# Altium project X_TRACK.PrjPcb
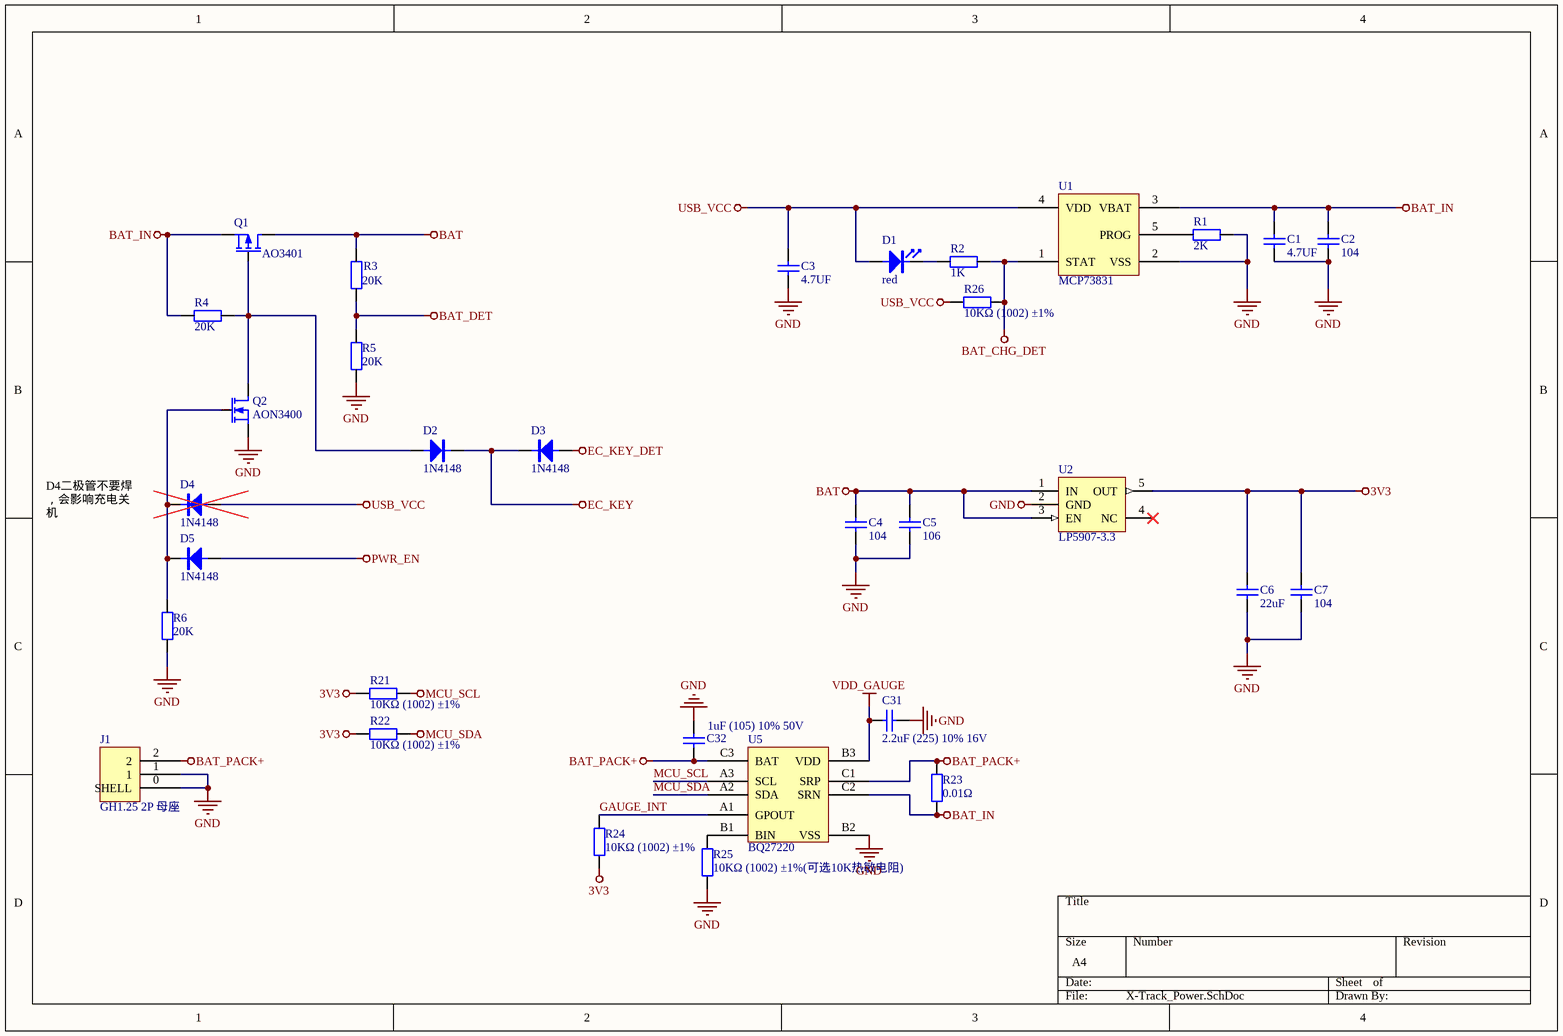
[diagram p0: X-Track_Power.SchDoc]
2 sheets, 86 parts. Net scope: global (net labels, ports and power ports of the same name join across sheets).
Board file: X-Track_2.0.PcbDoc
Sheets:
  X-Track_Power.SchDoc
  X-Track_Sheet.SchDoc

## Sheet X-Track_Power.SchDoc
size A4

### Parts
C1  4.7UF  [电容_C0805]
C2  104  [电容_C0603]
C3  4.7UF  [电容_C0805]
C4  104  [电容_C0603]
C5  106  [电容_C0603]
C6  22uF  [电容_C1206]
C7  104  [电容_C0603]
C31  2.2uF (225) 10% 16V  [0603_C]
C32  1uF (105) 10% 50V  [0603_C]
D1  red  [LED_0603]
D2  1N4148  [二极管_SOD-323]
D3  1N4148  [二极管_SOD-323]
D4  1N4148  [二极管_SOD-323]
D5  1N4148  [二极管_SOD-323]
J1  GH1.25 2P 母座  [GH1.25 2P 母座]
Q1  AO3401  [MOS_SOT-23]
Q2  AON3400  [MOS_SOT-23]
R1  2K  [电阻_R0603]
R2  1K  [电阻_R0603]
R3  20K  [电阻_R0603]
R4  20K  [电阻_R0603]
R5  20K  [电阻_R0603]
R6  20K  [电阻_R0603]
R21  10KΩ (1002) ±1%  [0603_R]
R22  10KΩ (1002) ±1%  [0603_R]
R23  0.01Ω  [0402_R]
R24  10KΩ (1002) ±1%  [0603_R]
R25  10KΩ (1002) ±1%(可选10K热敏电阻)  [0603_R]
R26  10KΩ (1002) ±1%  [0603_R]
U1  MCP73831  [SOT23-5]
U2  LP5907-3.3  [SOT23-5]
U5  BQ27220  [BQ27220]

### Nets
3V3: C6.2 C7.2 R21.2 R22.2 R24.1 U2.5(OUT)
BAT: C4.2 C5.2 Q1.2(D) R3.2 U2.1(IN) U2.3(EN)
BAT_CHG_DET: R2.1 R26.1 U1.1(STAT)
BAT_DET: R3.1 R5.2
BAT_IN: C1.2 C2.1 Q1.3(S) R4.1 R23.1 U1.3(VBAT) U5.C2(SRN)
BAT_PACK+: C32.2 J1.2 R23.2 U5.C1(SRP) U5.C3(BAT)
EC_KEY: D2.K D3.K
EC_KEY_DET: D3.A
GND: C1.1 C2.2 C3.1 C4.1 C5.1 C6.1 C7.1 C31.2 C32.1 J1.0(SHELL) J1.1 Q2.3(S) R1.1 R5.1 R6.2 R25.1 U1.2(VSS) U2.2(GND) U5.B2(VSS)
MCU_SCL: R21.1 U5.A3(SCL)
MCU_SDA: R22.1 U5.A2(SDA)
PWR_EN: D5.A
USB_VCC: C3.2 D1.A D4.A R26.2 U1.4(VDD)
VDD_GAUGE: C31.1 U5.B3(VDD)
GAUGE_INT: R24.2 U5.A1(GPOUT)
NetD1_K: D1.K R2.2
NetD2_A: D2.A Q1.1(G) Q2.2(D) R4.2
NetD4_K: D4.K D5.K Q2.1(G) R6.1
NetR1_2: R1.2 U1.5(PROG)
NetR25_2: R25.2 U5.B1(BIN)

Not connected (* = marked no-connect by the designer): U2 4(NC)*

### Notes on the sheet
- D4二极管不要焊，会影响充电关机

### Library data of the parts
C1-C7 = cap: U: 50V; 参数: Cap,0805,X7R,104K,50V,125C,±10%
  C1 C3: C: 4.7UF
  C2 C4 C7: C: 104
  C5: C: 106
  C6: C: 22uF
C31 = 0603 2.2uF (225) 10% 16V: 贴片电容; ComponentLink1Description: 供应商链接; ComponentLink1URL: http://www.szlcsc.com/product/details_24366.html; Package: 0603; Supplier: LC; SuppliersPartNumber: C23630
C32 = 0603 1uF (105) 10% 50V: 贴片电容; ComponentLink1Description: 供应商链接; ComponentLink1URL: http://www.szlcsc.com/product/details_16531.html; Package: 0603; Supplier: LC; SuppliersPartNumber: C15849
D1 = LED: 参数: LED,0603,Red
D2-D5 = Diode: _Specification: Diode,1N4148,SOD-323,1A,40V; _Comma: ,; _Footprint: SOD-323; _Voltage: 40V; _Current: 1A; _Name: Diode; _Model: 1N4148
Q1 = MOSFET-P: _Comma: ,; _Current: 40A; _Footprint: DFN3.3*3.3; _Name: P-MOSFET; _Specification: P-MOSFET,AO3401,DFN3.3*3.3,40A,20V; _Voltage: 20V; _Model: AO3401
Q2 = MOSFET-N: _Comma: ,; _Current: 150A; _Footprint: DFN5*6; _Name: N-MOSFET; _Specification: N-MOSFET,AON3400,DFN5*6,150A,30V; _Voltage: 30V; _Model: AON3400
R1-R6 = Res: P: 1/8W; 参数: Res,0805,0R,±1%,1/8W,100ppm,155C
  R1: R: 2K
  R2: R: 1K
  R3-R6: R: 20K
R21 R22 R24-R26 = 0603 10KΩ (1002) 1%: 贴片电阻; ComponentLink1Description: 供应商链接; ComponentLink1URL: http://www.szlcsc.com/product/details_26547.html; Package: 0603; Supplier: LC; SuppliersPartNumber: C25804
R23 = 0402 49.9Ω (49R9) 1%: 贴片电阻; ComponentLink1Description: 供应商链接; ComponentLink1URL: http://www.szlcsc.com/product/details_25863.html; Package: 0402; Supplier: LC; SuppliersPartNumber: C25120
U1 = MCP73831: 线性充电管理控制器
U2 = LP5907: LDO

## Sheet X-Track_Sheet.SchDoc
size A3
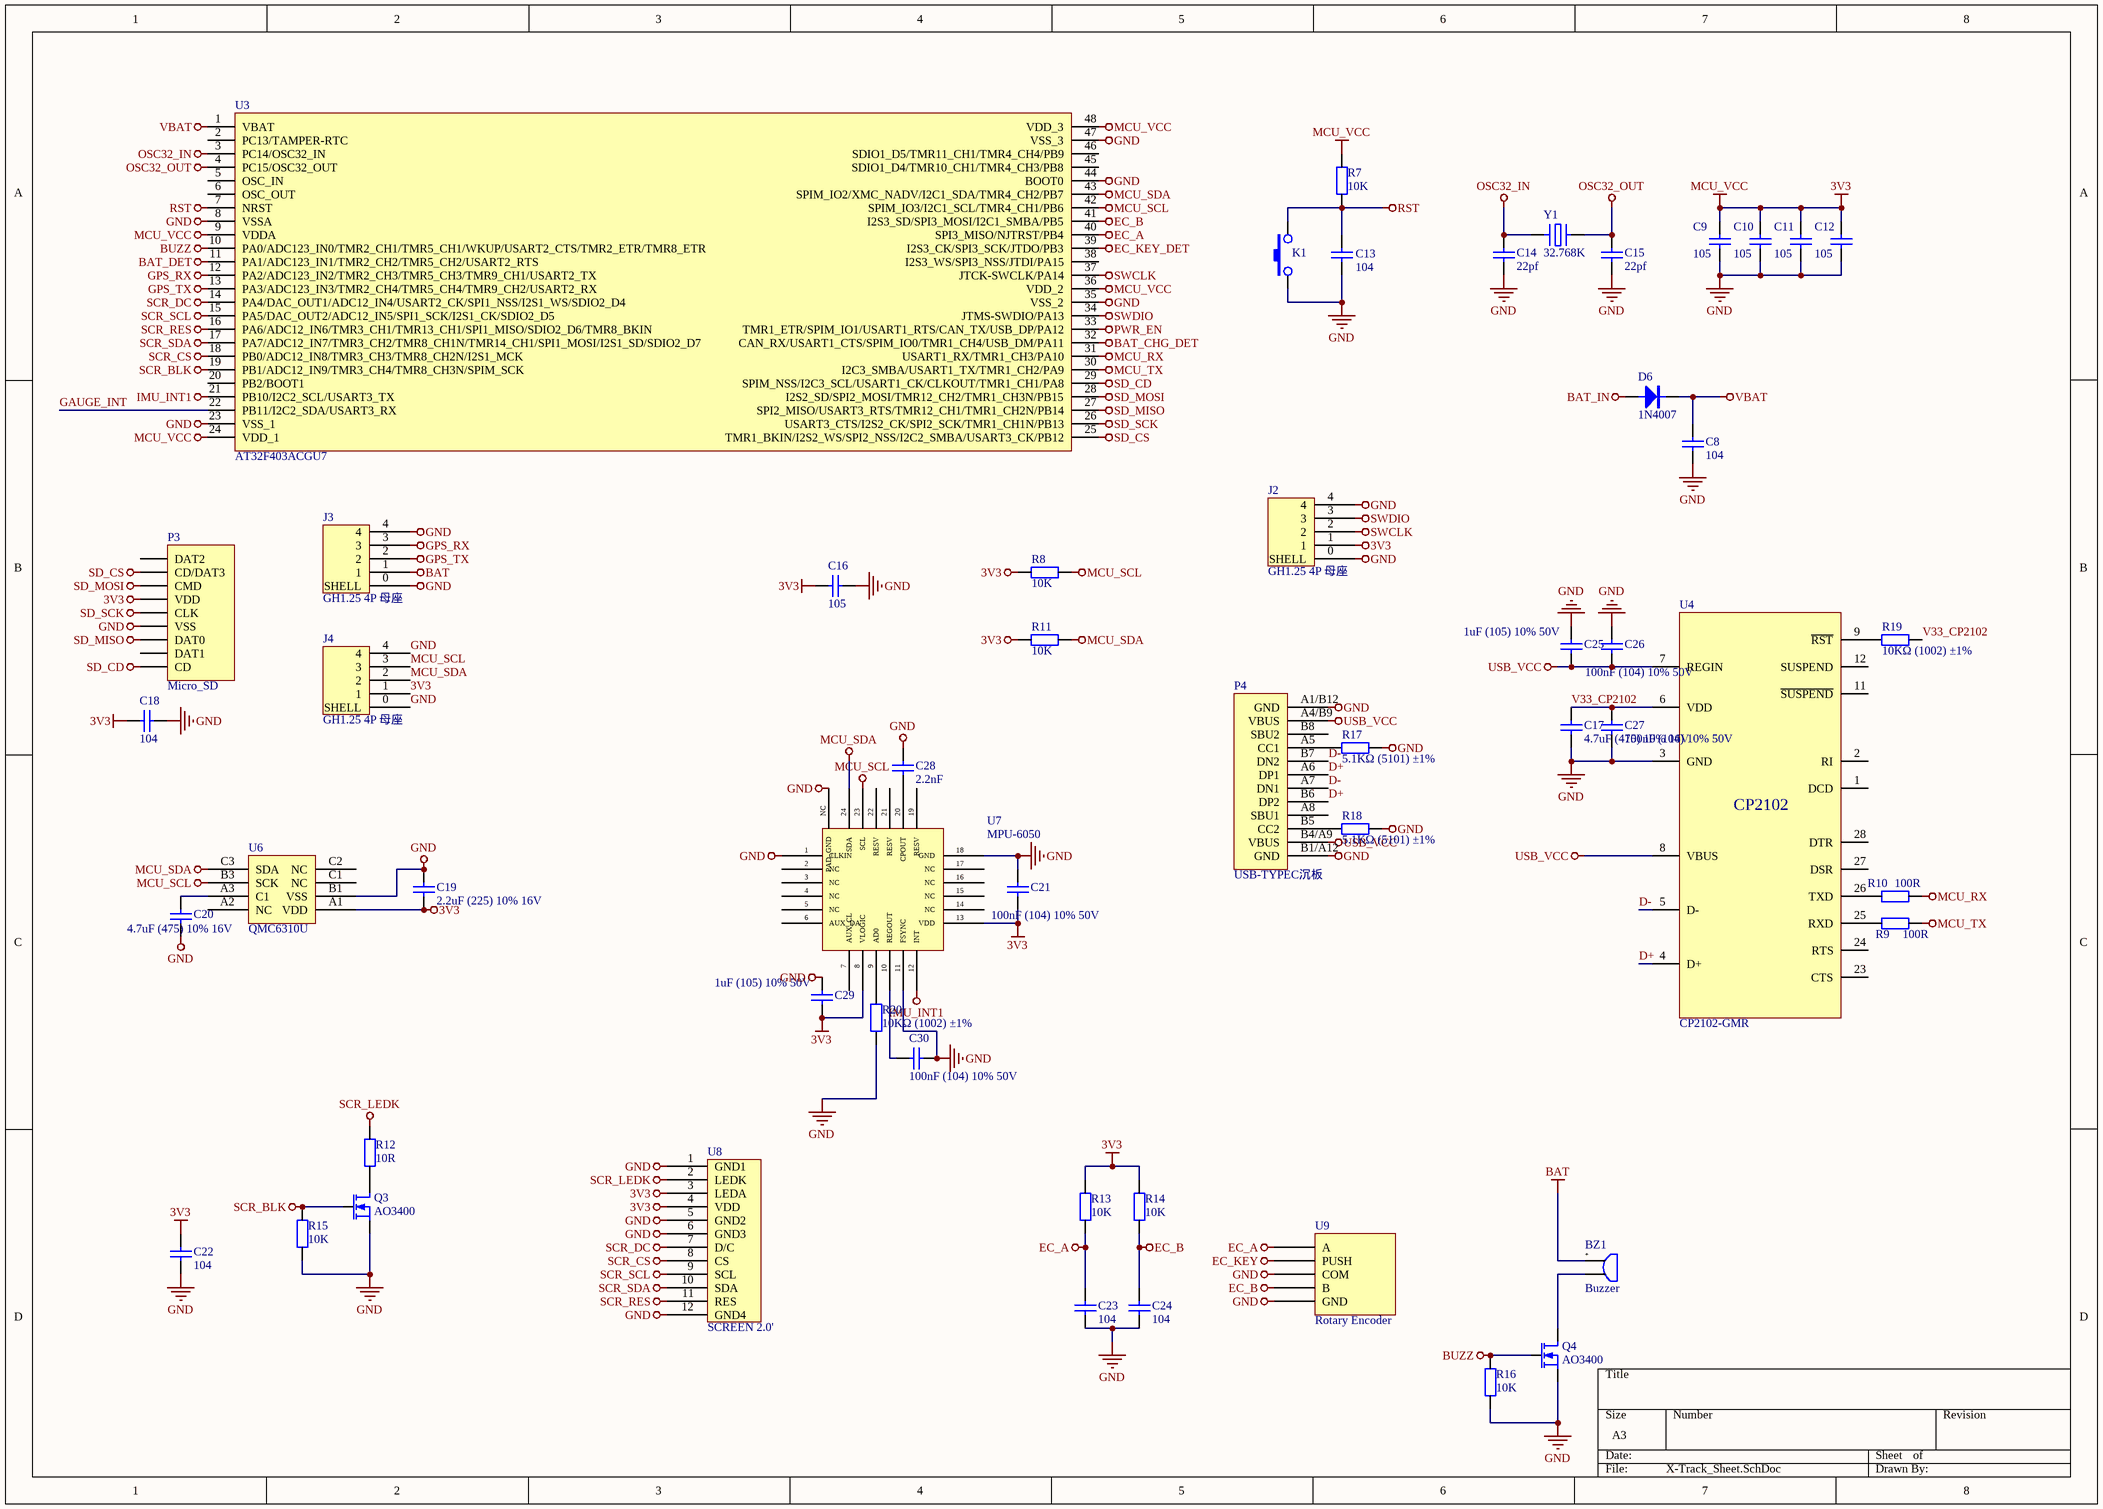
[diagram p1: X-Track_Sheet.SchDoc]

### Parts
BZ1  Buzzer  [蜂鸣器_SMD5020]
C8  104  [电容_C0603]
C9  105  [电容_C0603]
C10  105  [电容_C0603]
C11  105  [电容_C0603]
C12  105  [电容_C0603]
C13  104  [电容_C0603]
C14  22pf  [电容_C0603]
C15  22pf  [电容_C0603]
C16  105  [电容_C0603]
C17  4.7uF (475) 10% 16V  [0603_C]
C18  104  [电容_C0603]
C19  2.2uF (225) 10% 16V  [0603_C]
C20  4.7uF (475) 10% 16V  [0603_C]
C21  100nF (104) 10% 50V  [0603_C]
C22  104  [电容_C0603]
C23  104  [电容_C0603]
C24  104  [电容_C0603]
C25  1uF (105) 10% 50V  [0603_C]
C26  100nF (104) 10% 50V  [0603_C]
C27  100nF (104) 10% 50V  [0603_C]
C28  2.2nF  [0805_C]
C29  1uF (105) 10% 50V  [0603_C]
C30  100nF (104) 10% 50V  [0603_C]
D6  1N4007  [二极管_SOD-323]
J2  GH1.25 4P 母座  [GH1.25 4P 母座]
J3  GH1.25 4P 母座  [GH1.25 4P 母座]
J4  GH1.25 4P 母座  [GH1.25 4P 母座]
K1  SKRP  [开关按键_SKRP]  (value not drawn)
P3  Micro_SD  [接插件_Micro_SD]
P4  USB-TYPEC沉板  [USB-TYPEC-沉板]
Q3  AO3400  [MOS_SOT-23]
Q4  AO3400  [MOS_SOT-23]
R7  10K  [电阻_R0603]
R8  10K  [电阻_R0603]
R9  100R  [电阻_R0603]
R10  100R  [电阻_R0603]
R11  10K  [电阻_R0603]
R12  10R  [电阻_R0603]
R13  10K  [电阻_R0603]
R14  10K  [电阻_R0603]
R15  10K  [电阻_R0603]
R16  10K  [电阻_R0603]
R17  5.1KΩ (5101) ±1%  [0603_R]
R18  5.1KΩ (5101) ±1%  [0603_R]
R19  10KΩ (1002) ±1%  [0603_R]
R20  10KΩ (1002) ±1%  [0603_R]
U3  AT32F403ACGU7  [LQFP48 7X7_L]
U4  CP2102-GMR  [QFN-28_5x5x05P]
U6  QMC6310U  [QMC6310]
U7  MPU-6050  [MPU-6050]
U8  SCREEN 2.0'  [SCREEN 2.0' 12PIN]
U9  Rotary Encoder  [SIQ-02FVS3]
Y1  32.768K  [晶振_3215]

### Nets
3V3: C9.2 C10.2 C11.2 C12.2 C16.1 C18.1 C19.1 C21.1 C22.1 C29.1 J2.1 J4.1 P3.4(VDD) R7.2 R8.2 R11.2 R13.2 R14.2 U3.9(VDDA) U3.24(VDD_1) U3.36(VDD_2) U3.48(VDD_3) U6.A1(VDD) U7.8(VLOGIC) U7.13(VDD) U8.3(LEDA) U8.4(VDD)  [also labelled MCU_VCC]
BAT: BZ1.1 J3.1
BAT_CHG_DET: U3.32(CAN_RX/USART1_CTS/SPIM_IO0/TMR1_CH4/USB_DM/PA11)
BAT_DET: U3.11(PA1/ADC123_IN1/TMR2_CH2/TMR5_CH2/USART2_RTS)
BAT_IN: D6.A
BUZZ: Q4.1(G) R16.2 U3.10(PA0/ADC123_IN0/TMR2_CH1/TMR5_CH1/WKUP/USART2_CTS/TMR2_ETR/TMR8_ETR)
EC_A: C23.1 R13.1 U3.40(SPI3_MISO/NJTRST/PB4) U9.1(A)
EC_B: C24.1 R14.1 U3.41(I2S3_SD/SPI3_MOSI/I2C1_SMBA/PB5) U9.4(B)
EC_KEY: U9.2(PUSH)
EC_KEY_DET: U3.39(I2S3_CK/SPI3_SCK/JTDO/PB3)
GND: C8.1 C9.1 C10.1 C11.1 C12.1 C13.1 C14.2 C15.2 C16.2 C17.1 C18.2 C19.2 C20.1 C21.2 C22.2 C23.2 C24.2 C25.2 C26.2 C27.1 C28.2 C29.2 C30.1 J2.0(SHELL) J2.4 J3.0(SHELL) J3.4 J4.0(SHELL) J4.4 K1.1 P3.0(GND) P3.6(VSS) P4.A1/B12(GND) P4.B1/A12(GND) Q3.3(S) Q4.3(S) R15.1 R16.1 R17.2 R18.2 R20.1 U3.0(VSS) U3.8(VSSA) U3.23(VSS_1) U3.35(VSS_2) U3.44(BOOT0) U3.47(VSS_3) U4.3(GND) U6.B1(VSS) U7.1(CLKIN) U7.11(FSYNC) U7.18(GND) U7.NC(PAD_GND) U8.1(GND1) U8.5(GND2) U8.6(GND3) U8.12(GND4) U9.3(COM) U9.5(GND)
GPS_RX: J3.3 U3.12(PA2/ADC123_IN2/TMR2_CH3/TMR5_CH3/TMR9_CH1/USART2_TX)
GPS_TX: J3.2 U3.13(PA3/ADC123_IN3/TMR2_CH4/TMR5_CH4/TMR9_CH2/USART2_RX)
IMU_INT1: U3.21(PB10/I2C2_SCL/USART3_TX) U7.12(INT)
MCU_RX: R10.1 U3.31(USART1_RX/TMR1_CH3/PA10)
MCU_SCL: J4.3 R8.1 U3.42(SPIM_IO3/I2C1_SCL/TMR4_CH1/PB6) U6.B3(SCK) U7.23(SCL)
MCU_SDA: J4.2 R11.1 U3.43(SPIM_IO2/XMC_NADV/I2C1_SDA/TMR4_CH2/PB7) U6.C3(SDA) U7.24(SDA)
MCU_TX: R9.1 U3.30(I2C3_SMBA/USART1_TX/TMR1_CH2/PA9)
OSC32_IN: C14.1 U3.3(PC14/OSC32_IN) Y1.1
OSC32_OUT: C15.1 U3.4(PC15/OSC32_OUT) Y1.2
PWR_EN: U3.33(TMR1_ETR/SPIM_IO1/USART1_RTS/CAN_TX/USB_DP/PA12)
RST: C13.2 K1.2 R7.1 U3.7(NRST)
SCR_BLK: Q3.1(G) R15.2 U3.19(PB1/ADC12_IN9/TMR3_CH4/TMR8_CH3N/SPIM_SCK)
SCR_CS: U3.18(PB0/ADC12_IN8/TMR3_CH3/TMR8_CH2N/I2S1_MCK) U8.8(CS)
SCR_DC: U3.14(PA4/DAC_OUT1/ADC12_IN4/USART2_CK/SPI1_NSS/I2S1_WS/SDIO2_D4) U8.7(D/C)
SCR_LEDK: R12.2 U8.2(LEDK)
SCR_RES: U3.16(PA6/ADC12_IN6/TMR3_CH1/TMR13_CH1/SPI1_MISO/SDIO2_D6/TMR8_BKIN) U8.11(RES)
SCR_SCL: U3.15(PA5/DAC_OUT2/ADC12_IN5/SPI1_SCK/I2S1_CK/SDIO2_D5) U8.9(SCL)
SCR_SDA: U3.17(PA7/ADC12_IN7/TMR3_CH2/TMR8_CH1N/TMR14_CH1/SPI1_MOSI/I2S1_SD/SDIO2_D7) U8.10(SDA)
SD_CD: P3.9(CD) U3.29(SPIM_NSS/I2C3_SCL/USART1_CK/CLKOUT/TMR1_CH1/PA8)
SD_CS: P3.2(CD/DAT3) U3.25(TMR1_BKIN/I2S2_WS/SPI2_NSS/I2C2_SMBA/USART3_CK/PB12)
SD_MISO: P3.7(DAT0) U3.27(SPI2_MISO/USART3_RTS/TMR12_CH1/TMR1_CH2N/PB14)
SD_MOSI: P3.3(CMD) U3.28(I2S2_SD/SPI2_MOSI/TMR12_CH2/TMR1_CH3N/PB15)
SD_SCK: P3.5(CLK) U3.26(USART3_CTS/I2S2_CK/SPI2_SCK/TMR1_CH1N/PB13)
SWCLK: J2.2 U3.37(JTCK-SWCLK/PA14)
SWDIO: J2.3 U3.34(JTMS-SWDIO/PA13)
USB_VCC: C25.1 C26.1 P4.A4/B9(VBUS) P4.B4/A9(VBUS) U4.7(REGIN) U4.8(VBUS)
VBAT: C8.2 D6.K U3.1(VBAT)
D+: P4.A6(DP1) P4.B6(DP2) U4.4(D+)
D-: P4.A7(DN1) P4.B7(DN2) U4.5(D-)
GAUGE_INT: U3.22(PB11/I2C2_SDA/USART3_RX)
V33_CP2102: C17.2 C27.2 R19.1 U4.6(VDD)
NetBZ1_2: BZ1.2 Q4.2(D)
NetC20_2: C20.2 U6.A3(C1)
NetC28_1: C28.1 U7.20(CPOUT)
NetC30_2: C30.2 U7.10(REGOUT)
NetP4_A5: P4.A5(CC1) R17.1
NetP4_B5: P4.B5(CC2) R18.1
NetQ3_2: Q3.2(D) R12.1
NetR9_2: R9.2 U4.25(RXD)
NetR10_2: R10.2 U4.26(TXD)
NetR19_2: R19.2 U4.9(~{RST})
NetR20_2: R20.2 U7.9(AD0)

Not connected (* = marked no-connect by the designer): P3 1(DAT2) 8(DAT1); P4 A8(SBU1) B8(SBU2); U3 2(PC13/TAMPER-RTC) 5(OSC_IN) 6(OSC_OUT) 20(PB2/BOOT1) 38(I2S3_WS/SPI3_NSS/JTDI/PA15) 45(SDIO1_D4/TMR10_CH1/TMR4_CH3/PB8) 46(SDIO1_D5/TMR11_CH1/TMR4_CH4/PB9); U4 1(DCD) 2(RI) 11(~{SUSPEND}) 12(SUSPEND) 23(CTS) 24(RTS) 27(DSR) 28(DTR); U6 A2(NC) C1(NC) C2(NC); U7 2(NC) 3(NC) 4(NC) 5(NC) 6(AUX_DA) 7(AUX_CL) 14(NC) 15(NC) 16(NC) 17(NC) 19(RESV) 21(RESV) 22(RESV)

### Notes on the sheet
- (in symbol BZ) +
- (in symbol CP2102-GMR_[C6568]) CP2102

### Library data of the parts
BZ1 = BZ: _Comma: ,; _Footprint: 12*9.5mm,SOT塑封管; _Model: 12V; _Specification: Buzzer,12V,12*9.5mm,SOT塑封管; _Name: Buzzer
C8-C16 C18 C22-C24 = cap: as C1 on sheet X-Track_Power
  C8 C13 C18 C22-C24: C: 104
  C9-C12 C16: C: 105
  C14 C15: C: 22pf
C17 C20 = 0603 4.7uF (475) 10% 16V: 贴片电容; ComponentLink1Description: 供应商链接; ComponentLink1URL: http://www.szlcsc.com/product/details_20375.html; Package: 0603; Supplier: LC; SuppliersPartNumber: C19666
C19 = 0603 2.2uF (225) 10% 16V: 贴片电容; ComponentLink1Description: 供应商链接; ComponentLink1URL: http://www.szlcsc.com/product/details_24366.html; Package: 0603; Supplier: LC; SuppliersPartNumber: C23630
C21 C26 C27 C30 = 0603 100nF (104) 10% 50V: 贴片电容; ComponentLink1Description: 供应商链接; ComponentLink1URL: http://www.szlcsc.com/product/details_15331.html; Package: 0603; Supplier: LC; SuppliersPartNumber: C14663
C25 C29 = 0603 1uF (105) 10% 50V: 贴片电容; ComponentLink1Description: 供应商链接; ComponentLink1URL: http://www.szlcsc.com/product/details_16531.html; Package: 0603; Supplier: LC; SuppliersPartNumber: C15849
C28 = 0805 2.2nF (222) 5% 50V: 贴片电容; ComponentLink1Description: 供应商链接; ComponentLink1URL: http://www.szlcsc.com/product/details_29010.html; Package: 0805; Supplier: LC; SuppliersPartNumber: C28260
D6 = Diode: _Specification: Diode,1N4007,SOD-323,1A,40V; _Comma: ,; _Footprint: SOD-323; _Voltage: 40V; _Current: 1A; _Name: Diode; _Model: 1N4007
K1 = SW-PB: _Comma: ,; _Name: KEY; _Specification: KEY,SKRP,*; _Footprint: *; _Model: SKRP
P3 = Micro_SD: _Comma: ,; _Name: Port; _Specification: Port,Micro_SD,TF,9PIN; _Value: TF,9PIN; _Model: Micro_SD
Q3 Q4 = MOSFET-N: _Comma: ,; _Current: 150A; _Footprint: DFN5*6; _Name: N-MOSFET; _Specification: N-MOSFET,AO3400,DFN5*6,150A,30V; _Voltage: 30V; _Model: AO3400
R7 R9 R10 R15 R16 = Res: as R1 on sheet X-Track_Power
  R7 R15 R16: R: 10K
  R9 R10: R: 100R
R8 R11 R13 R14 = Res: _Accuracy: 1%; _Power: 1/8W; _Footprint: 0805; _Drift: 100ppm; _Comma: ,; _Specification: Res,0805,10K,1%,1/8W,100ppm; _Name: Res; _Value: 10K
R12 = Res: _Accuracy: 1%; _Power: 1/8W; _Footprint: 0805; _Drift: 100ppm; _Comma: ,; _Specification: Res,0805,10R,1%,1/8W,100ppm; _Name: Res; _Value: 10R
R17 R18 = 0603 5.1KΩ (5101) 1%: 贴片电阻; ComponentLink1Description: 供应商链接; ComponentLink1URL: http://www.szlcsc.com/product/details_23913.html; Package: 0603; Supplier: LC; SuppliersPartNumber: C23186
R19 R20 = 0603 10KΩ (1002) 1%: 贴片电阻; ComponentLink1Description: 供应商链接; ComponentLink1URL: http://www.szlcsc.com/product/details_26547.html; Package: 0603; Supplier: LC; SuppliersPartNumber: C25804
U3 = AT32F403CGU6: _Footprint: QFN48; _Comma: ,; _Name: MCU; _Specification: MCU,AT32F403ACGU7,QFN48; _Model: AT32F403ACGU7
U4 = CP2102-GMR_[C6568]: USB; ComponentLink1Description: 供应商链接; ComponentLink1URL: http://www.szlcsc.com/product/details_7033.html; Package: QFN-28_5x5x05P; Supplier: LC; SuppliersPartNumber: C6568
U7 = MPU-6050: 姿态传感器
Y1 = XTAL_A: _Name: CRYSTALS; _Comma: ,; _Specification: CRYSTALS,32.768K,*,10ppm,12pF; _Accuracy: 10ppm; _CL: 12pF; _Footprint: *; _Frequency: 32.768K

## Nets that join several sheets
3V3: X-Track_Power (6 pins), X-Track_Sheet (27 pins)
BAT: X-Track_Power (6 pins), X-Track_Sheet (BZ1.1 J3.1)
BAT_CHG_DET: X-Track_Power (R2.1 R26.1 U1.1), X-Track_Sheet (U3.32)
BAT_DET: X-Track_Power (R3.1 R5.2), X-Track_Sheet (U3.11)
BAT_IN: X-Track_Power (7 pins), X-Track_Sheet (D6.A)
EC_KEY: X-Track_Power (D2.K D3.K), X-Track_Sheet (U9.2)
EC_KEY_DET: X-Track_Power (D3.A), X-Track_Sheet (U3.39)
GND: X-Track_Power (19 pins), X-Track_Sheet (59 pins)
MCU_SCL: X-Track_Power (R21.1 U5.A3), X-Track_Sheet (5 pins)
MCU_SDA: X-Track_Power (R22.1 U5.A2), X-Track_Sheet (5 pins)
PWR_EN: X-Track_Power (D5.A), X-Track_Sheet (U3.33)
USB_VCC: X-Track_Power (5 pins), X-Track_Sheet (6 pins)
GAUGE_INT: X-Track_Power (R24.2 U5.A1), X-Track_Sheet (U3.22)